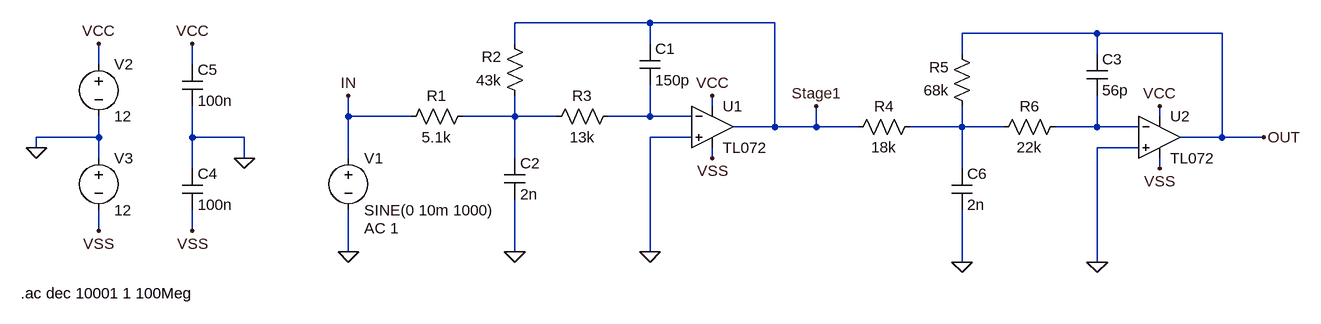
[diagram p0: schematic MFGK_ordnung4_10kHz_1dB_30dB_butter.asc]
MFGK_ordnung4_10kHz_1dB_30dB_butter.asc, the LTspice schematic file:
Version 4
SHEET 1 1316 736
WIRE 240 128 32 128
WIRE 432 128 240 128
WIRE 928 144 720 144
WIRE 1120 144 928 144
WIRE 32 160 32 128
WIRE 240 160 240 128
WIRE 720 176 720 144
WIRE 928 176 928 144
WIRE -608 192 -608 160
WIRE -464 192 -464 160
WIRE 336 256 336 240
WIRE -224 272 -224 240
WIRE -128 272 -224 272
WIRE 32 272 32 240
WIRE 32 272 -48 272
WIRE 96 272 32 272
WIRE 240 272 240 224
WIRE 240 272 176 272
WIRE 304 272 240 272
WIRE 1024 272 1024 256
WIRE 432 288 432 128
WIRE 432 288 368 288
WIRE 496 288 496 256
WIRE 496 288 432 288
WIRE 560 288 496 288
WIRE 720 288 720 256
WIRE 720 288 640 288
WIRE 784 288 720 288
WIRE 928 288 928 240
WIRE 928 288 864 288
WIRE 992 288 928 288
WIRE -608 304 -608 272
WIRE -608 304 -704 304
WIRE -464 304 -464 256
WIRE -384 304 -464 304
WIRE 304 304 240 304
WIRE 1120 304 1120 144
WIRE 1120 304 1056 304
WIRE 1184 304 1120 304
WIRE -704 320 -704 304
WIRE 992 320 928 320
WIRE -608 336 -608 304
WIRE -384 336 -384 304
WIRE -224 336 -224 272
WIRE 32 336 32 272
WIRE 336 336 336 320
WIRE -464 352 -464 304
WIRE 720 352 720 288
WIRE 1024 352 1024 336
WIRE -608 448 -608 416
WIRE -464 448 -464 416
WIRE -224 480 -224 416
WIRE 32 480 32 400
WIRE 240 480 240 304
WIRE 720 496 720 416
WIRE 928 496 928 320
FLAG -608 160 VCC
FLAG -608 448 VSS
FLAG -704 320 0
FLAG -464 160 VCC
FLAG -464 448 VSS
FLAG -384 336 0
FLAG -224 480 0
FLAG -224 240 IN
FLAG 336 240 VCC
FLAG 336 336 VSS
FLAG 240 480 0
FLAG 32 480 0
FLAG 496 256 Stage1
FLAG 1024 256 VCC
FLAG 1024 352 VSS
FLAG 928 496 0
FLAG 720 496 0
FLAG 1184 304 OUT
SYMBOL voltage -224 320 R0
WINDOW 123 24 124 Left 2
WINDOW 39 0 0 Left 0
SYMATTR Value2 AC 1
SYMATTR InstName V1
SYMATTR Value SINE(0 10m 1000)
SYMBOL voltage -608 176 R0
WINDOW 123 0 0 Left 0
WINDOW 39 0 0 Left 0
SYMATTR InstName V2
SYMATTR Value 12
SYMBOL voltage -608 320 R0
WINDOW 123 0 0 Left 0
WINDOW 39 0 0 Left 0
SYMATTR InstName V3
SYMATTR Value 12
SYMBOL cap -480 192 R0
SYMATTR InstName C5
SYMATTR Value 100n
SYMBOL cap -480 352 R0
SYMATTR InstName C4
SYMATTR Value 100n
SYMBOL res -32 256 R90
WINDOW 0 0 56 VBottom 2
WINDOW 3 32 56 VTop 2
SYMATTR InstName R1
SYMATTR Value 5.1k
SYMBOL res 48 256 R180
WINDOW 0 36 76 Left 2
WINDOW 3 36 40 Left 2
SYMATTR InstName R2
SYMATTR Value 43k
SYMBOL res 80 288 R270
WINDOW 0 32 56 VTop 2
WINDOW 3 0 56 VBottom 2
SYMATTR InstName R3
SYMATTR Value 13k
SYMBOL cap 224 160 R0
SYMATTR InstName C1
SYMATTR Value 150p
SYMBOL cap 16 336 R0
SYMATTR InstName C2
SYMATTR Value 2n
SYMBOL TL072 336 224 R0
SYMATTR InstName U1
SYMBOL res 656 272 R90
WINDOW 0 0 56 VBottom 2
WINDOW 3 32 56 VTop 2
SYMATTR InstName R4
SYMATTR Value 18k
SYMBOL res 736 272 R180
WINDOW 0 36 76 Left 2
WINDOW 3 36 40 Left 2
SYMATTR InstName R5
SYMATTR Value 68k
SYMBOL res 768 304 R270
WINDOW 0 32 56 VTop 2
WINDOW 3 0 56 VBottom 2
SYMATTR InstName R6
SYMATTR Value 22k
SYMBOL cap 912 176 R0
SYMATTR InstName C3
SYMATTR Value 56p
SYMBOL cap 704 352 R0
SYMATTR InstName C6
SYMATTR Value 2n
SYMBOL TL072 1024 240 R0
SYMATTR InstName U2
TEXT -728 544 Left 2 !.ac dec 10001 1 100Meg

The netlist it stands for:
* MFGK_ordnung4_10kHz_1dB_30dB_butter.asc
V1 IN 0 SINE(0 10m 1000) AC 1
V2 VCC 0 12
V3 0 VSS 12
C5 VCC 0 100n
C4 0 VSS 100n
R1 N001 IN 5.1k
R2 N001 Stage1 43k
R3 N001 N002 13k
C1 Stage1 N002 150p
C2 N001 0 2n
* U1: TL072 (symbol TL072 not available, pins judged from their places): In+=0 In-=N002 V+=VCC V-=VSS OUT=Stage1
R4 N003 Stage1 18k
R5 N003 OUT 68k
R6 N003 N004 22k
C3 OUT N004 56p
C6 N003 0 2n
* U2: TL072 (symbol TL072 not available, pins judged from their places): In+=0 In-=N004 V+=VCC V-=VSS OUT=OUT
.ac dec 10001 1 100Meg
.backanno
.end